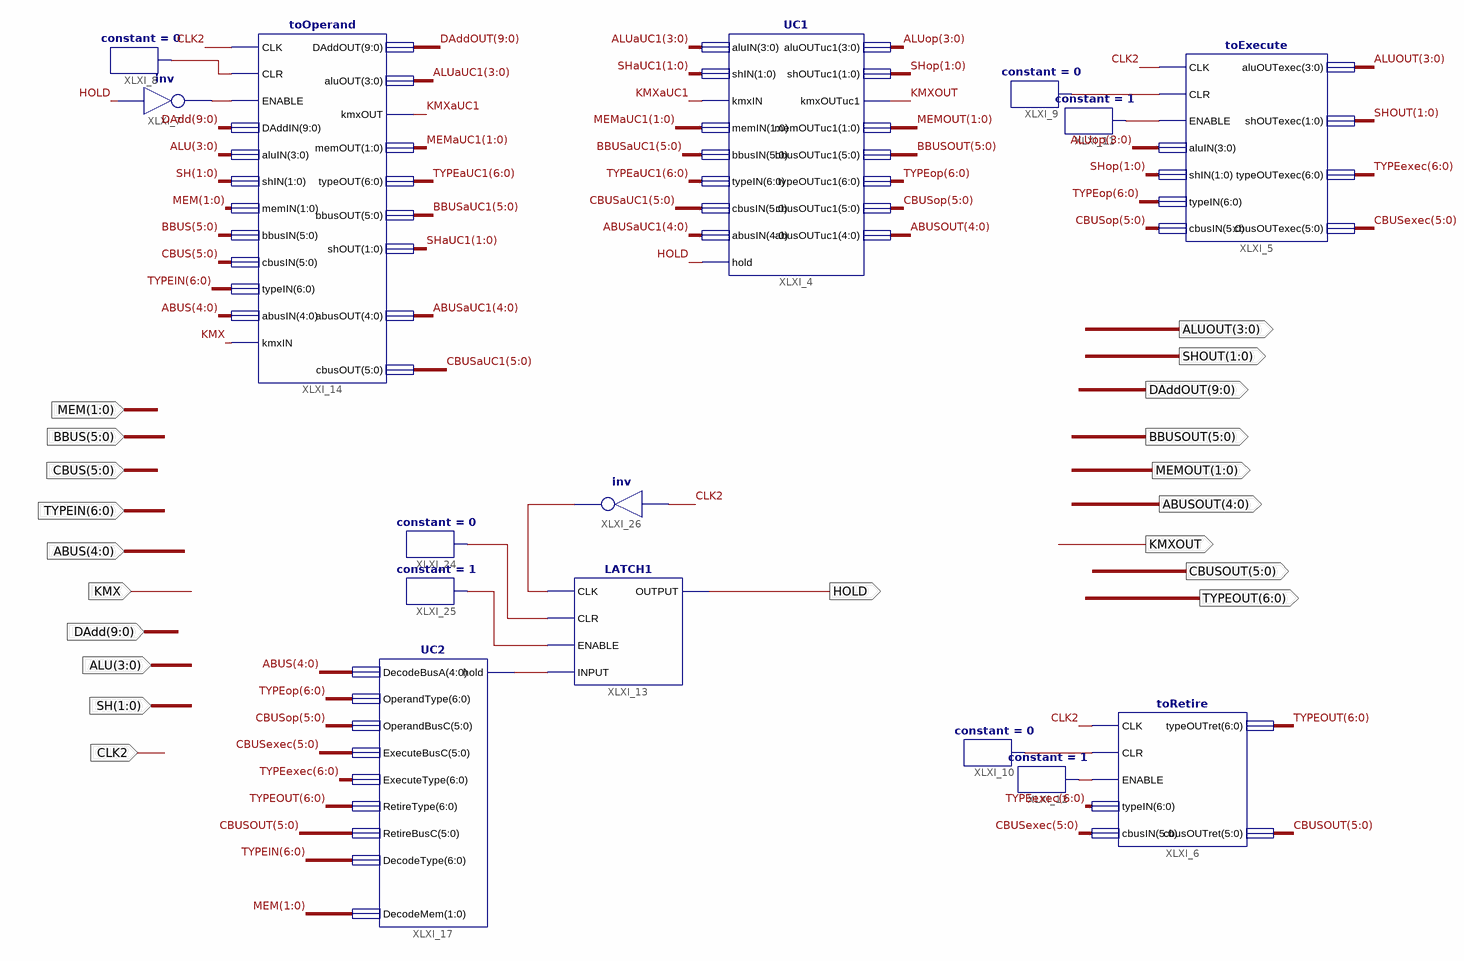
[diagram p0: schematic sheet 1]
// Xilinx ISE schematic Tuberia.sch (artix7) as structural Verilog: 15 symbols, 20 ports
module Tuberia (
  input  CLK2,
  input  [9:0] DAdd,
  input  [3:0] ALU,
  input  [1:0] SH,
  input  [1:0] MEM,
  input  [5:0] BBUS,
  input  [5:0] CBUS,
  input  [6:0] TYPEIN,
  input  [4:0] ABUS,
  input  KMX,
  output [9:0] DAddOUT,
  output [5:0] BBUSOUT,
  output [1:0] MEMOUT,
  output [4:0] ABUSOUT,
  output KMXOUT,
  output [3:0] ALUOUT,
  output [1:0] SHOUT,
  output [5:0] CBUSOUT,
  output [6:0] TYPEOUT,
  output HOLD
);

  wire KMXaUC1, XLXN_2, XLXN_11, XLXN_49, XLXN_50, XLXN_60, XLXN_61, XLXN_66, XLXN_67, XLXN_77, XLXN_80;
  wire [1:0] MEMaUC1, SHaUC1, SHop;
  wire [3:0] ALUaUC1, ALUop;
  wire [4:0] ABUSaUC1;
  wire [5:0] BBUSaUC1, CBUSaUC1, CBUSexec, CBUSop;
  wire [6:0] TYPEaUC1, TYPEexec, TYPEop;

  not XLXI_7 (XLXN_2, HOLD);
  constant #(.CValue("0")) XLXI_8 (.O(XLXN_11));
  UC1 XLXI_4 (
    .aluIN(ALUaUC1), .shIN(SHaUC1), .kmxIN(KMXaUC1), .memIN(MEMaUC1), .bbusIN(BBUSaUC1), .typeIN(TYPEaUC1),
    .cbusIN(CBUSaUC1), .abusIN(ABUSaUC1), .hold(HOLD), .aluOUTuc1(ALUop), .shOUTuc1(SHop),
    .kmxOUTuc1(KMXOUT), .memOUTuc1(MEMOUT), .bbusOUTuc1(BBUSOUT), .typeOUTuc1(TYPEop), .cbusOUTuc1(CBUSop),
    .abusOUTuc1(ABUSOUT));
  toExecute XLXI_5 (
    .CLK(CLK2), .CLR(XLXN_49), .ENABLE(XLXN_50), .aluIN(ALUop), .shIN(SHop), .typeIN(TYPEop),
    .cbusIN(CBUSop), .aluOUTexec(ALUOUT), .shOUTexec(SHOUT), .typeOUTexec(TYPEexec), .cbusOUTexec(CBUSexec));
  constant #(.CValue("1")) XLXI_11 (.O(XLXN_50));
  constant #(.CValue("0")) XLXI_9 (.O(XLXN_49));
  toOperand XLXI_14 (
    .CLK(CLK2), .CLR(XLXN_11), .ENABLE(XLXN_2), .DAddIN(DAdd), .aluIN(ALU), .shIN(SH), .memIN(MEM),
    .bbusIN(BBUS), .cbusIN(CBUS), .typeIN(TYPEIN), .abusIN(ABUS), .kmxIN(KMX), .DAddOUT(DAddOUT),
    .aluOUT(ALUaUC1), .kmxOUT(KMXaUC1), .memOUT(MEMaUC1), .typeOUT(TYPEaUC1), .bbusOUT(BBUSaUC1),
    .shOUT(SHaUC1), .abusOUT(ABUSaUC1), .cbusOUT(CBUSaUC1));
  UC2 XLXI_17 (
    .DecodeBusA(ABUS), .OperandType(TYPEop), .OperandBusC(CBUSop), .ExecuteBusC(CBUSexec),
    .ExecuteType(TYPEexec), .RetireType(TYPEOUT), .RetireBusC(CBUSOUT), .DecodeType(TYPEIN), .hold(XLXN_77),
    .DecodeMem(MEM));
  LATCH1 XLXI_13 (.CLK(XLXN_66), .CLR(XLXN_67), .ENABLE(XLXN_80), .INPUT(XLXN_77), .OUTPUT(HOLD));
  constant #(.CValue("0")) XLXI_24 (.O(XLXN_67));
  constant #(.CValue("1")) XLXI_25 (.O(XLXN_80));
  not XLXI_26 (XLXN_66, CLK2);
  constant #(.CValue("1")) XLXI_12 (.O(XLXN_61));
  constant #(.CValue("0")) XLXI_10 (.O(XLXN_60));
  toRetire XLXI_6 (
    .CLK(CLK2), .CLR(XLXN_60), .ENABLE(XLXN_61), .typeIN(TYPEexec), .cbusIN(CBUSexec), .typeOUTret(TYPEOUT),
    .cbusOUTret(CBUSOUT));
endmodule
